# EAGLE schematic tyraka (EAGLE 9.3.0)
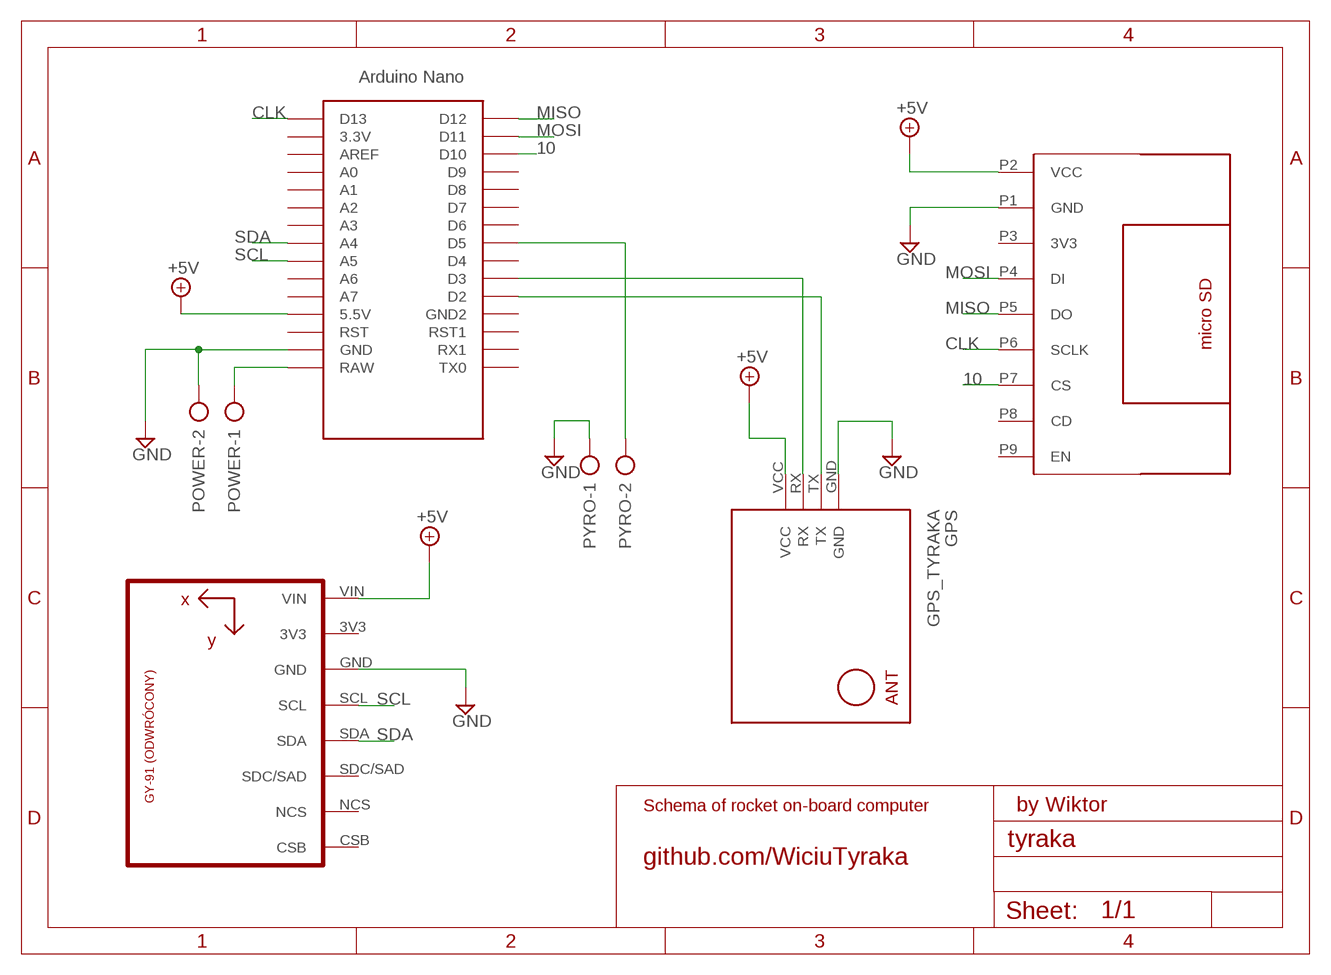
[diagram p0: schematic, sheet 1]

## Parts
ARDUINO  NANO  [NANO]
GPS  GPS_TYRAKA  [GPS-RECEIVER-NEO6M]
POWER  AK500/2  [AK500/2]
PYRO  AK500/2  [AK500/2]
SD1  MICRO_SD  [MICRO_SD]
U1  GY-521MPU6050  [GY-521]

## Nets
10: ARDUINO.D10 SD1.P7(CS)
+5V: ARDUINO.5V(5.5V) GPS.VCC SD1.P2(VCC) U1.VIN
CLK: ARDUINO.D13 SD1.P6(SCLK)
GND: ARDUINO.GND GPS.GND POWER.2 PYRO.1 SD1.P1(GND) U1.GND
MISO: ARDUINO.D12 SD1.P5(DO)
MOSI: ARDUINO.D11 SD1.P4(DI)
N$1: ARDUINO.D5 PYRO.2
N$2: ARDUINO.D2 GPS.TX
N$3: ARDUINO.D3 GPS.RX
RAW: ARDUINO.RAW POWER.1
SCL: ARDUINO.A5 U1.SCL
SDA: ARDUINO.A4 U1.SDA
Unconnected: ARDUINO.3.3V ARDUINO.A0 ARDUINO.A1 ARDUINO.A2 ARDUINO.A3 ARDUINO.A6 ARDUINO.A7 ARDUINO.AREF ARDUINO.D4 ARDUINO.D6 ARDUINO.D7 ARDUINO.D8 ARDUINO.D9 ARDUINO.GND1(GND2) ARDUINO.ICSP1 ARDUINO.ICSP2 ARDUINO.ICSP3 ARDUINO.ICSP4 ARDUINO.ICSP5 ARDUINO.ICSP6 ARDUINO.RST ARDUINO.RST1 ARDUINO.RX1 ARDUINO.TX0 SD1.P3(3V3) SD1.P8(CD) SD1.P9(EN) U1.3V3 U1.CSB U1.NCS U1.SDC/SAD

## Notes on the sheet
- Schema of rocket on-board computer | by Wiktor
- github.com/WiciuTyraka

## Library data of the parts
ARDUINO = Arduino-clone:NANO: Arduino Nano
GPS = gps_tyraka:GPS_TYRAKA
POWER PYRO = con-ptr500:AK500/2: CONNECTOR; OC_FARNELL: unknown; OC_NEWARK: unknown
SD1 = 111_microsd:MICRO_SD
U1 = BAROMETR:GY-521